# Altium schematic sheet suns_wifi_egse_esp8266.SchDoc: Top
size A4; SheetNumber: 1; SheetTotal: 1
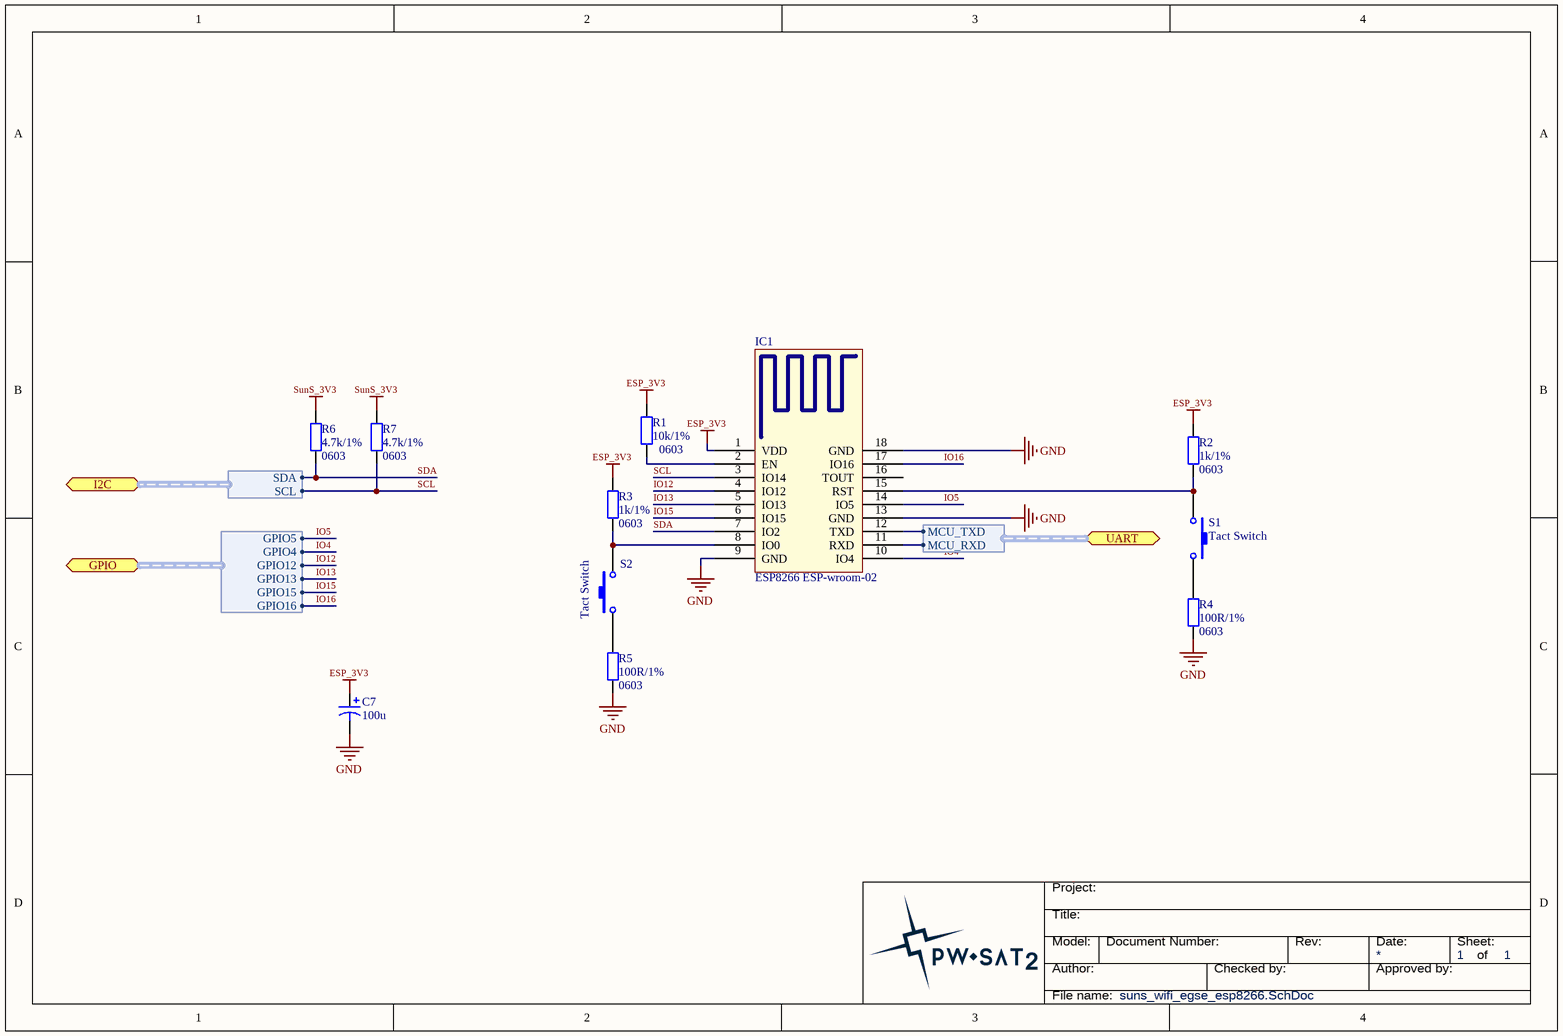
[diagram p0: suns_wifi_egse_esp8266.SchDoc]

## Parts
C7  100u  [CAP_ELEC_6.3x4.2]
IC1  ESP8266 ESP-wroom-02  [ESP8266 ESP-wroom-02]
R1  Package: 0603  [SMD_Resistor_0603]  (hidden comment: 10k/1%)
R2  Package: 0603  [SMD_Resistor_0603]  (hidden comment: 1k/1%)
R3  Package: 0603  [SMD_Resistor_0603]  (hidden comment: 1k/1%)
R4  Package: 0603  [SMD_Resistor_0603]  (hidden comment: 100R/1%)
R5  Package: 0603  [SMD_Resistor_0603]  (hidden comment: 100R/1%)
R6  Package: 0603  [SMD_Resistor_0603]  (hidden comment: 4.7k/1%)
R7  Package: 0603  [SMD_Resistor_0603]  (hidden comment: 4.7k/1%)
S1  Tact Switch  [Tact Switch 3x6]
S2  Tact Switch  [Tact Switch 3x6]

## Ports
GPIO (harness GPIO), I2C (harness I2C), UART (harness UART)

## Harnesses
UART: MCU_RXD, MCU_TXD
I2C: SCL, SDA
GPIO: GPIO4, GPIO5, GPIO12, GPIO13, GPIO15, GPIO16

## Nets
ESP_3V3: C7.1 IC1.1(VDD) R1.2 R2.2 R3.2
GND: C7.2 IC1.9(GND) IC1.13(GND) IC1.18(GND) R4.1 R5.1
SunS_3V3: R6.1 R7.1
IO4: IC1.10(IO4) ; port GPIO.GPIO4
IO5: IC1.14(IO5) ; port GPIO.GPIO5
IO12: IC1.4(IO12) ; port GPIO.GPIO12
IO13: IC1.5(IO13) ; port GPIO.GPIO13
IO15: IC1.6(IO15) ; port GPIO.GPIO15
IO16: IC1.17(IO16) ; port GPIO.GPIO16
SCL: IC1.3(IO14) R7.2 ; port I2C.SCL
SDA: IC1.7(IO2) R6.2 ; port I2C.SDA
NetIC1_2: IC1.2(EN) R1.1
NetIC1_8: IC1.8(IO0) R3.1 S2.2
NetIC1_11: IC1.11(RXD) ; port UART.MCU_RXD
NetIC1_12: IC1.12(TXD) ; port UART.MCU_TXD
NetIC1_15: IC1.15(RST) R2.1 S1.2
NetR4_2: R4.2 S1.1
NetR5_2: R5.2 S2.1

Not connected (* = marked no-connect by the designer): IC1 16(TOUT)

## Notes on the sheet
- Title:
- Project:
- Author:
- Model:
- Document Number:
- Checked by:
- Rev:
- Date:
- Approved by:
- Sheet:
- of
- File name:

## Library data of the parts
C7 = Cap Pol: Polarized Capacitor; value: 100u; ComponentLink1Description: Datasheet
R1-R5 = CRCW06031K00FKxxxx: 1k/1% Vishay CRCW 0603 Resistor. 100mW, 100ppm, 75V.; Manufacturer: Vishay; ManufacturerPartNumber: CRCW06031K00FKxxxx
  R1: Value: 10k/1%
  R2 R3: Value: 1k/1%
  R4 R5: Value: 100R/1%
R6 R7 = CRCW06034K70FKxxxx: 4.7k/1% Vishay CRCW 0603 Resistor. 100mW, 100ppm, 75V.; Manufacturer: Vishay; ManufactuerPartNumber: CRCW06034K70FKxxxx; Value: 4.7k/1%
S1 S2 = TactSwitch: Supplier 1: Farnell